# Altium schematic sheet Power.SchDoc
size A4
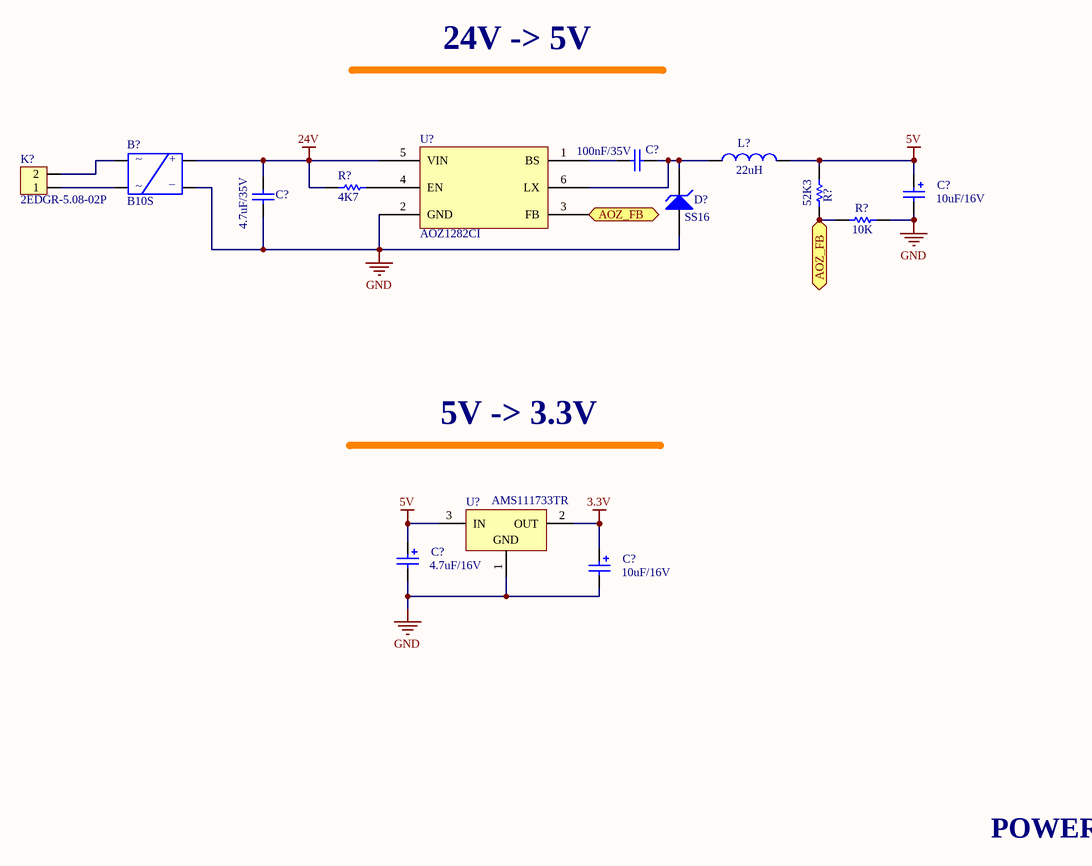
[diagram p0: Power.SchDoc]

## Parts
(Parts that share a designator on the sheet are numbered #1, #2 ... from top to bottom, then left to right.)
B?  B10S  [B10S]
C?#1  100nF/35V  [CAP0603W]
C?#2  10uF/16V  [CAP A]
C?#3  4.7uF/35V  [CAP1206W]
C?#4  4.7uF/16V  [CAP A]
C?#5  10uF/16V  [CAP A]
D?  SS16  [DO214AC]
K?  2EDGR-5.08-02P  [CON_DG129_02P]
L?  22uH  [INDUCTOR C43]
R?#1  52K3  [RES1608[0603]]
R?#2  4K7  [RES1608[0603]]
R?#3  10K  [RES1608[0603]]
U?#1  AOZ1282CI  [SOT23-6]
U?#2  AMS111733TR  [SOT-223-2]

## Ports
AOZ_FB

## Nets
3.3V: C?#5.1 U?#2.2(OUT)
5V: C?#2.1 C?#4.1 L?.2 R?#1.1 U?#2.3(IN)
24V: B?.3 C?#3.1 R?#2.2 U?#1.5(VIN)
GND: B?.4 C?#2.2 C?#3.2 C?#4.2 C?#5.2 D?.1(A) R?#3.1 U?#1.2(GND) U?#2.1(GND)
AOZ_FB: R?#1.2 R?#3.2 U?#1.3(FB) ; port AOZ_FB
NetB?_1: B?.1 K?.2
NetB?_2: B?.2 K?.1
NetC?#1_1: C?#1.1 U?#1.1(BS)
NetC?#1_2: C?#1.2 D?.2(K) L?.1 U?#1.6(LX)
NetR?#2_1: R?#2.1 U?#1.4(EN)

## Notes on the sheet
- 24V -> 5V
- 5V -> 3.3V
- POWER
- (in symbol BRIDGE RECTIFIER) ~; +; _

## Library data of the parts
B? = BRIDGE RECTIFIER: DIODE B10S MIC SMD; RB156: RB156
C?#1 = CAP1: CAPACITOR 0603 Case; Value: 100nF; Published: 8-Jun-2000; LatestRevisionDate: 17-Jul-2002; LatestRevisionNote: Re-released for DXP Platform.; PackageReference: C1206; Publisher: Altium Limited
C?#2 C?#4 C?#5 = CAP2: CAPACITOR Polarized Capacitor; Value: 100uF; Published: 8-Jun-2000; LatestRevisionDate: 17-Jul-2002; LatestRevisionNote: Re-released for DXP Platform.; PackageReference: RB7.6-15; Publisher: Altium Limited
C?#3 = CAP1: CAPACITOR 1206Case; Value: 100nF; Published: 8-Jun-2000; LatestRevisionDate: 17-Jul-2002; LatestRevisionNote: Re-released for DXP Platform.; PackageReference: C1206; Publisher: Altium Limited
D? = DIODE: DIODE SCHOTTKY SS16 1A 60V DO214AC SMA; Published: 8-Jun-2000; LatestRevisionDate: 17-Jul-2002; LatestRevisionNote: Re-released for DXP Platform.; PackageReference: DIODE-0.7; Publisher: Altium Limited
K? = KLEMENS_2P: CONNECTOR 5.08mm 2PIN 90DEG
L? = INDUCTOR: INDUCTOR 22uH SDR43-220M-LF SMD 4.5X4X3.2MM; Code_IEC: 1005; Published: 8-Jun-2000; LatestRevisionDate: 17-Jul-2002; LatestRevisionNote: Re-released for DXP Platform.; PackageReference: 0402-A; Publisher: Altium Limited; Code_JEITA: 0402
R?#1-R?#3 = RES: RESISTOR 0603 Case %1; Value: 430R; Published: 8-Jun-2000; LatestRevisionDate: 17-Jul-2002; LatestRevisionNote: Re-released for DXP Platform.; PackageReference: AXIAL-0.5; Publisher: Altium Limited
U?#1 = AOZ1282CI: REGULATOR IC-1282 REG BUCK ADJ 1.2A SOT23-6
U?#2 = AMS111733TR: IC-1117 REG LDO 3.3V 1A SOT223; Note: Tab is connected to pin 3 (GND).; Published: 24-Aug-2001; LatestRevisionDate: 17-Jul-2002; LatestRevisionNote: Re-released for DXP Platform.; DatasheetDocument: Dec-1998; PackageDocument: Jun-1998; PackageReference: TO220ABN; Publisher: Altium Limited; ComponentLink1Description: Manufacturer Link; ComponentLink1URL: http://www.st.com/